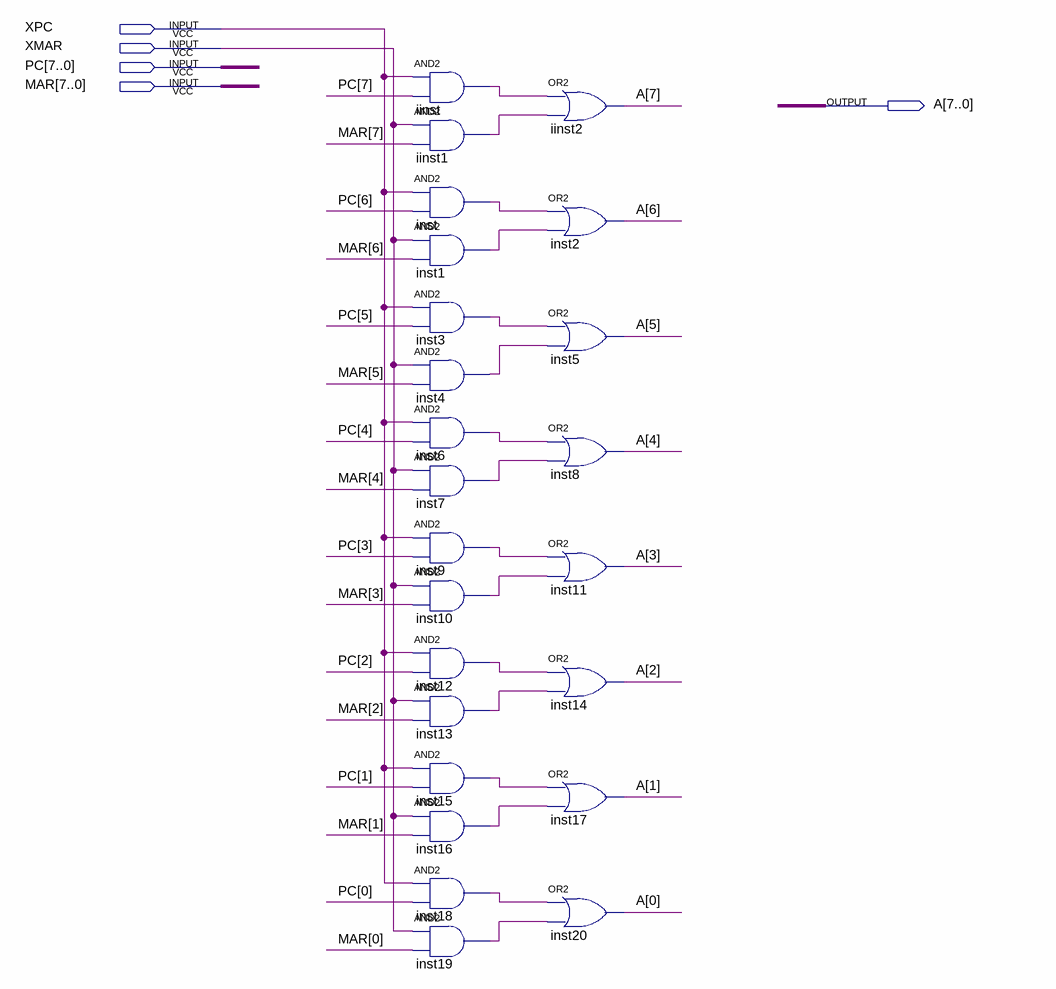
[diagram p0: schematic sheet]
// Quartus schematic Data_Selector.bdf as structural Verilog: 24 symbols, 5 pins
module Data_Selector (
  input  XPC,
  input  XMAR,
  input  [7:0] PC,
  input  [7:0] MAR,
  output [7:0] A
);

  wire iinst1_out, iinst_out, inst1_out, inst3_out, inst4_out, inst6_out, inst7_out, inst9_out, inst10_out,
       inst12_out, inst13_out, inst15_out, inst16_out, inst18_out, inst19_out, inst_out;

  and iinst (iinst_out, XPC, PC[7]);
  and iinst1 (iinst1_out, XMAR, MAR[7]);
  and inst (inst_out, XPC, PC[6]);
  and inst1 (inst1_out, XMAR, MAR[6]);
  and inst3 (inst3_out, XPC, PC[5]);
  and inst4 (inst4_out, XMAR, MAR[5]);
  and inst6 (inst6_out, XPC, PC[4]);
  and inst7 (inst7_out, XMAR, MAR[4]);
  and inst9 (inst9_out, XPC, PC[3]);
  and inst10 (inst10_out, XMAR, MAR[3]);
  and inst12 (inst12_out, XPC, PC[2]);
  and inst13 (inst13_out, XMAR, MAR[2]);
  and inst15 (inst15_out, XPC, PC[1]);
  and inst16 (inst16_out, XMAR, MAR[1]);
  and inst18 (inst18_out, XPC, PC[0]);
  and inst19 (inst19_out, XMAR, MAR[0]);
  or iinst2 (A[7], iinst_out, iinst1_out);
  or inst2 (A[6], inst_out, inst1_out);
  or inst5 (A[5], inst3_out, inst4_out);
  or inst8 (A[4], inst6_out, inst7_out);
  or inst11 (A[3], inst9_out, inst10_out);
  or inst14 (A[2], inst12_out, inst13_out);
  or inst17 (A[1], inst15_out, inst16_out);
  or inst20 (A[0], inst18_out, inst19_out);
endmodule
